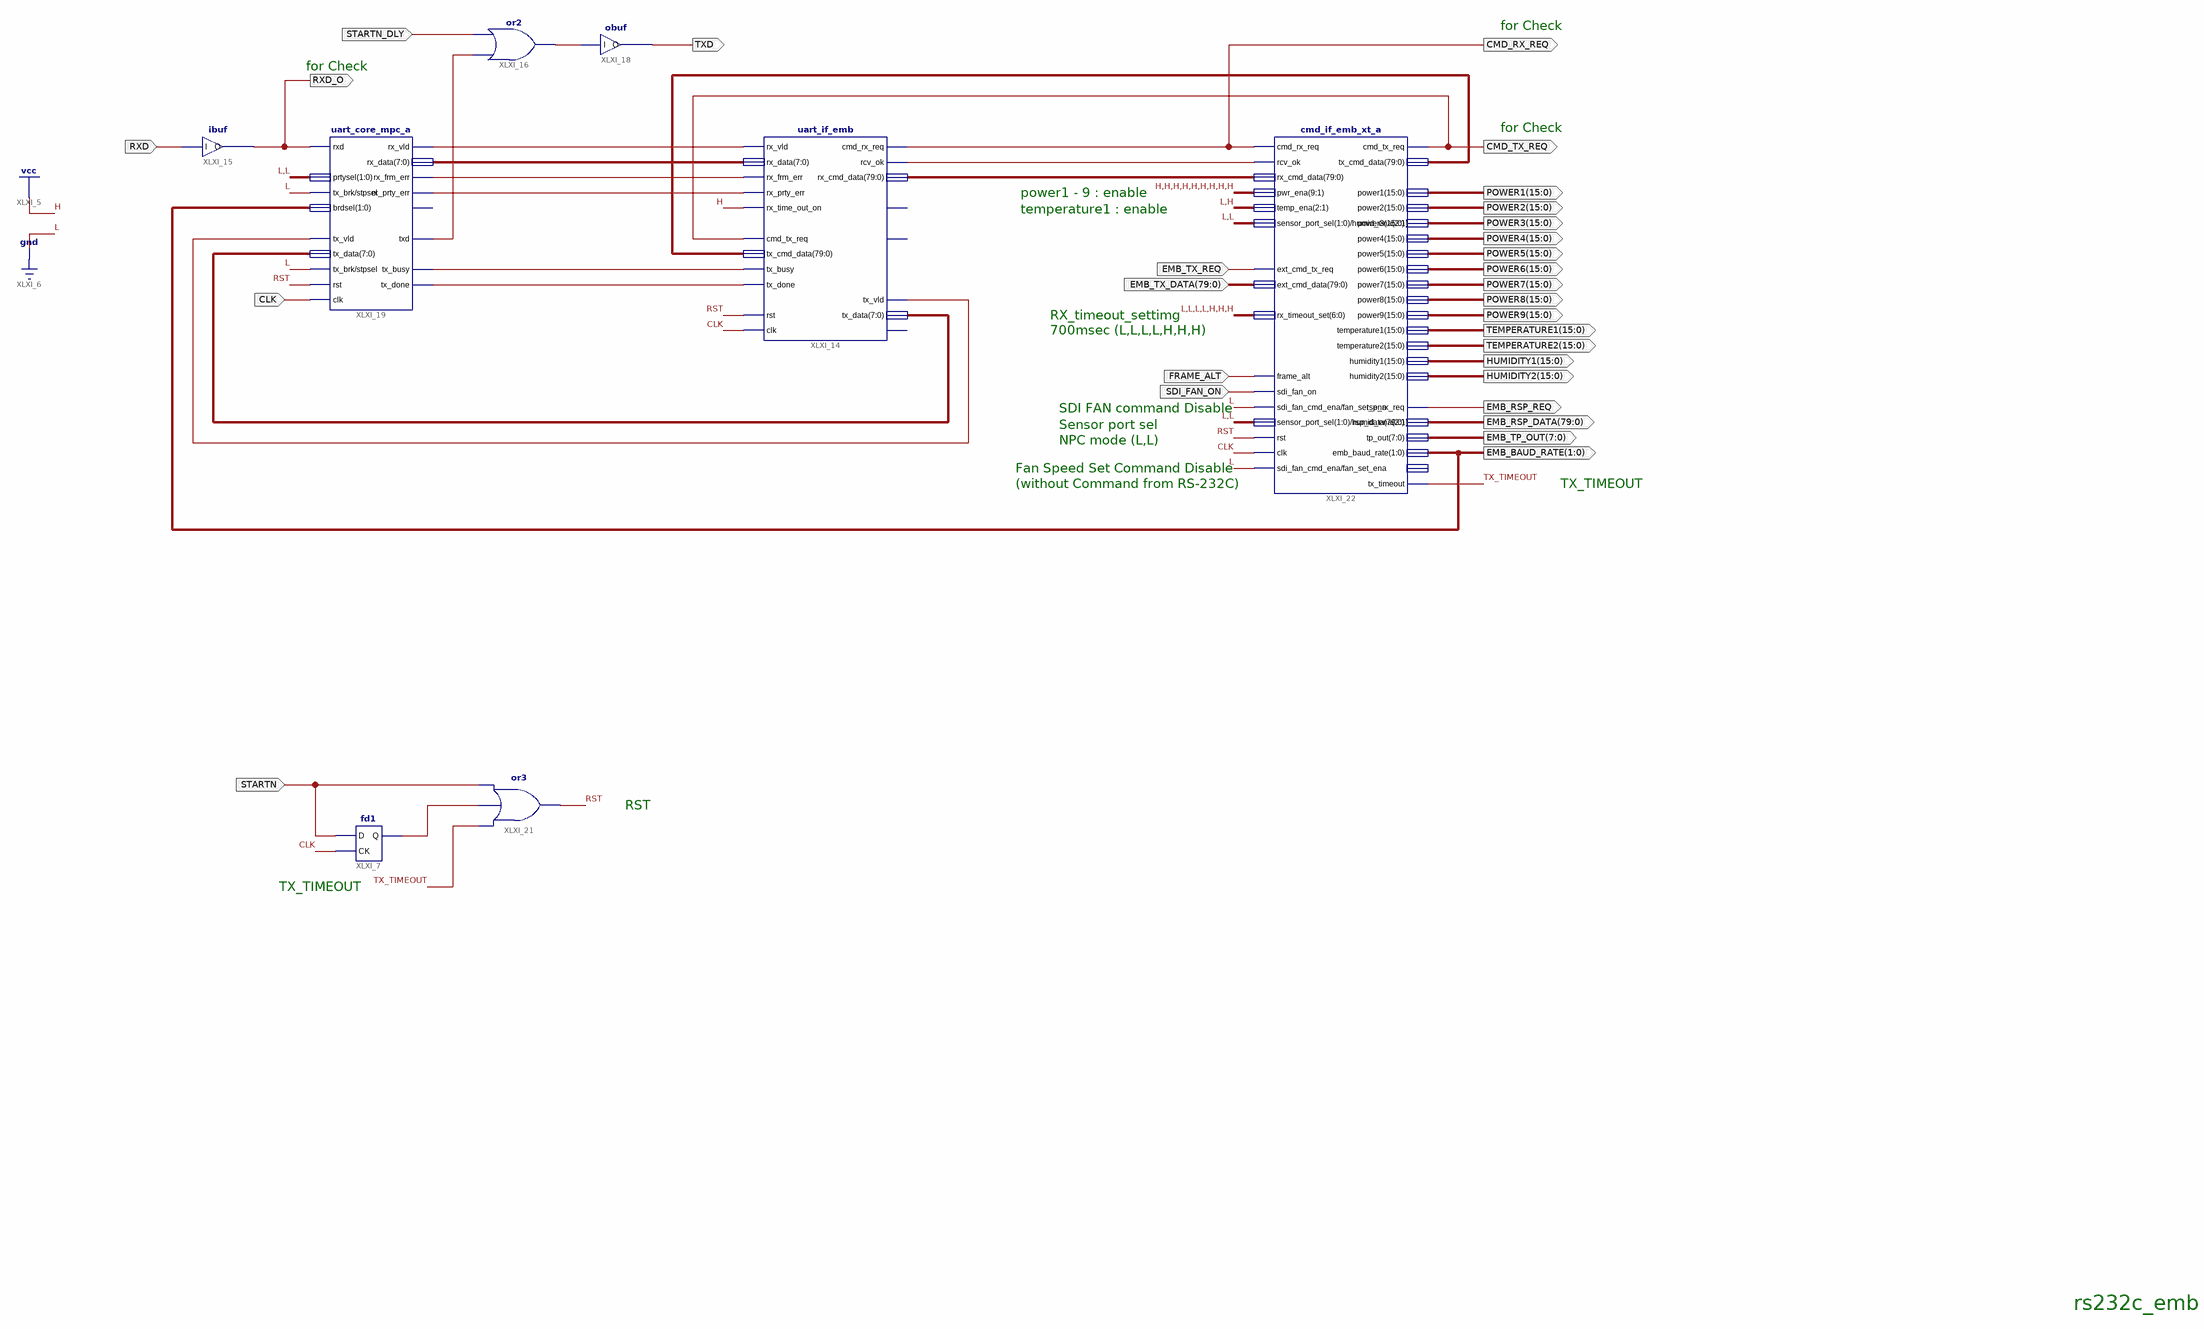
[diagram p0: schematic sheet 1]
// Xilinx ISE schematic rs232c_emb.sch (spartan6) as structural Verilog: 8 symbols, 29 ports
module rs232c_emb (
  input  CLK,
  input  STARTN,
  input  EMB_TX_REQ,
  input  [79:0] EMB_TX_DATA,
  input  FRAME_ALT,
  input  RXD,
  input  STARTN_DLY,
  input  SDI_FAN_ON,
  output [1:0] EMB_BAUD_RATE,
  output CMD_RX_REQ,
  output CMD_TX_REQ,
  output [15:0] POWER1,
  output [15:0] POWER2,
  output [15:0] POWER3,
  output [15:0] POWER4,
  output [15:0] POWER5,
  output [15:0] POWER6,
  output [15:0] POWER7,
  output [15:0] POWER8,
  output [15:0] POWER9,
  output [15:0] TEMPERATURE1,
  output [15:0] TEMPERATURE2,
  output EMB_RSP_REQ,
  output [79:0] EMB_RSP_DATA,
  output [15:0] HUMIDITY1,
  output [15:0] HUMIDITY2,
  output RXD_O,
  output TXD,
  output [7:0] EMB_TP_OUT
);

  wire RST, TX_TIMEOUT, XLXN_80, XLXN_82, XLXN_83, XLXN_85, XLXN_98, XLXN_99, XLXN_100, XLXN_138, XLXN_154,
       XLXN_159;
  wire [7:0] XLXN_12, XLXN_81;
  wire [79:0] XLXN_142, XLXN_144;

  fd1 XLXI_7 (.D(STARTN), .CK(CLK), .Q(XLXN_138));
  uart_if_emb XLXI_14 (
    .rx_vld(XLXN_80), .rx_frm_err(XLXN_82), .rx_prty_err(XLXN_83), .rx_time_out_on(1'b1), .rx_data(XLXN_81),
    .rcv_ok(XLXN_85), .cmd_rx_req(CMD_RX_REQ), .rx_cmd_data(XLXN_144), .cmd_tx_req(CMD_TX_REQ),
    .tx_cmd_data(XLXN_142), .tx_busy(XLXN_99), .tx_done(XLXN_100), .rst(RST), .clk(CLK), .tx_vld(XLXN_98),
    .tx_data(XLXN_12));  // open: rx_time_out, cmd_tx_done, tx_brk
  ibuf XLXI_15 (.I(RXD), .O(RXD_O));
  or XLXI_16 (XLXN_159, XLXN_154, STARTN_DLY);
  obuf XLXI_18 (.I(XLXN_159), .O(TXD));
  uart_core_mpc_a XLXI_19 (
    .clk(CLK), .rst(RST), .rxd(RXD_O), .tx_vld(XLXN_98), .tx_brk(1'b0), .stpsel(1'b0), .tx_data(XLXN_12),
    .prtysel(2'b00), .brdsel(EMB_BAUD_RATE), .txd(XLXN_154), .tx_busy(XLXN_99), .tx_done(XLXN_100),
    .rx_vld(XLXN_80), .rx_frm_err(XLXN_82), .rx_prty_err(XLXN_83), .rx_data(XLXN_81));  // open: rx_brk
  or XLXI_21 (RST, TX_TIMEOUT, XLXN_138, STARTN);
  cmd_if_emb_xt_a XLXI_22 (
    .clk(CLK), .rst(RST), .frame_alt(FRAME_ALT), .cmd_rx_req(CMD_RX_REQ), .rcv_ok(XLXN_85),
    .ext_cmd_tx_req(EMB_TX_REQ), .sdi_fan_on(SDI_FAN_ON), .sdi_fan_cmd_ena(1'b0), .fan_set_ena(1'b0),
    .sensor_port_sel(2'b00), .rx_cmd_data(XLXN_144), .ext_cmd_data(EMB_TX_DATA), .rx_timeout_set(7'b0000111),
    .pwr_ena({9{1'b1}}), .temp_ena(2'b01), .humid_ena(2'b00), .cmd_tx_req(CMD_TX_REQ),
    .tx_timeout(TX_TIMEOUT), .rsp_rx_req(EMB_RSP_REQ), .tx_cmd_data(XLXN_142), .power1(POWER1),
    .power2(POWER2), .power3(POWER3), .power4(POWER4), .power5(POWER5), .power6(POWER6), .power7(POWER7),
    .power8(POWER8), .power9(POWER9), .temperature1(TEMPERATURE1), .temperature2(TEMPERATURE2),
    .humidity1(HUMIDITY1), .humidity2(HUMIDITY2), .rsp_data(EMB_RSP_DATA), .emb_baud_rate(EMB_BAUD_RATE),
    .tp_out(EMB_TP_OUT));  // open: sens_num

  // Notes on the sheet:
  //   for Check
  //   for Check
  //   for Check
  //   power1 - 9 : enable
  //   temperature1 : enable
  //   RX_timeout_settimg
  //   700msec (L,L,L,L,H,H,H)
  //   SDI FAN command Disable
  //   Sensor port sel
  //   NPC mode (L,L)
  //   Fan Speed Set Command Disable
  //   (without Command from RS-232C)
  //   TX_TIMEOUT
  //   RST
  //   TX_TIMEOUT
  //   rs232c_emb
endmodule
